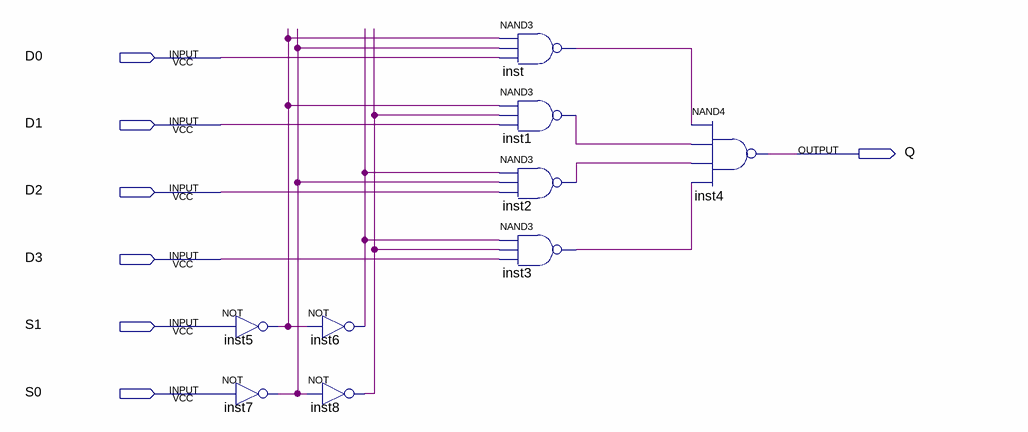
[diagram p0: schematic sheet]
// Quartus schematic mux41x.bdf as structural Verilog: 9 symbols, 7 pins
module mux41x (
  input  D0,
  input  D1,
  input  D2,
  input  D3,
  input  S1,
  input  S0,
  output Q
);

  wire inst1_out, inst2_out, inst3_out, inst5_out, inst6_out, inst7_out, inst8_out, inst_out;

  not inst5 (inst5_out, S1);
  not inst7 (inst7_out, S0);
  not inst6 (inst6_out, inst5_out);
  not inst8 (inst8_out, inst7_out);
  nand inst (inst_out, inst5_out, inst7_out, D0);
  nand inst1 (inst1_out, inst5_out, inst8_out, D1);
  nand inst2 (inst2_out, inst6_out, inst7_out, D2);
  nand inst3 (inst3_out, inst6_out, inst8_out, D3);
  nand inst4 (Q, inst_out, inst1_out, inst2_out, inst3_out);
endmodule
